# Altium schematic sheet MOTHER.SchDoc
size A4
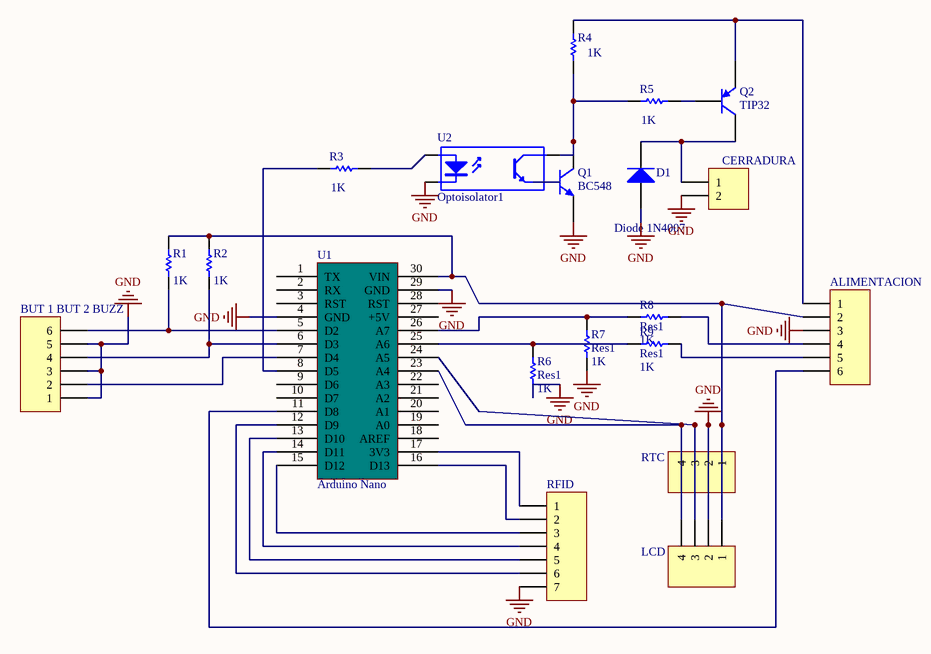
[diagram p0: MOTHER.SchDoc]

## Parts
ALIMENTACION  Header 6  [BORNERA 6 PIN]  (value not drawn)
BUT_1_BUT_2_BUZZ  Header 6  [BORNERA 6 PIN]  (value not drawn)
CERRADURA  Header 2  [Bornera 2 pin]  (value not drawn)
D1  Diode 1N4007  [DO-41]
LCD  Header 4  [BORNERA 4 PIN]  (value not drawn)
Q1  BC548  [TO-92A]
Q2  TIP32  [TO-220AB]
R1  value 1K  [AXIAL-0.3]  (hidden comment: Res1)
R2  value 1K  [AXIAL-0.3]  (hidden comment: Res1)
R3  value 1K  [AXIAL-0.3]  (hidden comment: Res1)
R4  value 1K  [AXIAL-0.3]  (hidden comment: Res1)
R5  value 1K  [AXIAL-0.3]  (hidden comment: Res1)
R6  Res1  value 1K  [AXIAL-0.3]
R7  Res1  value 1K  [AXIAL-0.3]
R8  Res1  value 1K  [AXIAL-0.3]
R9  Res1  value 1K  [AXIAL-0.3]
RFID  Header 7  [BORNERA 7 PIN]  (value not drawn)
RTC  Header 4  [BORNERA 4 PIN]  (value not drawn)
U1  Arduino Nano  [Arduino nano]
U2  Optoisolator1  [DIP-6]

## Nets
GND: ALIMENTACION.3 BUT_1_BUT_2_BUZZ.1 BUT_1_BUT_2_BUZZ.3 BUT_1_BUT_2_BUZZ.5 CERRADURA.2 D1.1(A) LCD.2 Q1.1(E) R6.1 R7.1 RFID.7 RTC.2 U1.4(GND) U1.29(GND) U2.2(K)
NetALIMENTACION_1: ALIMENTACION.1 Q2.1(E) R4.2
NetALIMENTACION_2: ALIMENTACION.2 LCD.1 R1.2 R2.2 RTC.1 U1.30(VIN)
NetALIMENTACION_4: ALIMENTACION.4 R8.2
NetALIMENTACION_5: ALIMENTACION.5 R9.2
NetALIMENTACION_6: ALIMENTACION.6 U1.11(D8)
NetBUT_1_BUT_2_BUZZ_2: BUT_1_BUT_2_BUZZ.2 U1.7(D4)
NetBUT_1_BUT_2_BUZZ_4: BUT_1_BUT_2_BUZZ.4 R2.1 U1.6(D3)
NetBUT_1_BUT_2_BUZZ_6: BUT_1_BUT_2_BUZZ.6 R1.1 U1.5(D2)
NetCERRADURA_1: CERRADURA.1 D1.2(K) Q2.3(C)
NetLCD_3: LCD.3 RTC.3 U1.24(A5)
NetLCD_4: LCD.4 RTC.4 U1.23(A4)
NetQ1_2: Q1.2(B) U2.3(E)
NetQ1_3: Q1.3(C) R4.1 R5.1 U2.4(C)
NetQ2_2: Q2.2(B) R5.2
NetR3_1: R3.1 U1.8(D5)
NetR3_2: R3.2 U2.1(A)
NetR6_2: R6.2 R9.1 U1.25(A6)
NetR7_2: R7.2 R8.1 U1.26(A7)
NetRFID_1: RFID.1 U1.17(3V3)
NetRFID_2: RFID.2 U1.16(D13)
NetRFID_3: RFID.3 U1.15(D12)
NetRFID_4: RFID.4 U1.14(D11)
NetRFID_5: RFID.5 U1.13(D10)
NetRFID_6: RFID.6 U1.12(D9)

Not connected (* = marked no-connect by the designer): U1 1(TX) 2(RX) 3(RST) 9(D6) 10(D7) 18(AREF) 19(A0) 20(A1) 21(A2) 22(A3) 27(+5V) 28(RST)

## Library data of the parts
ALIMENTACION = Header 6: Header, 6-Pin; pin to pad: 1>6 2>3 3>2 4>5 5>4 6>1; LatestRevisionDate: 17-Jul-2002; LatestRevisionNote: Re-released for DXP Platform.; Publisher: Altium Limited
BUT_1_BUT_2_BUZZ = Header 6: Header, 6-Pin; LatestRevisionDate: 17-Jul-2002; LatestRevisionNote: Re-released for DXP Platform.; Publisher: Altium Limited
CERRADURA = Header 2: Header, 2-Pin; pin to pad: 1>2 2>1; LatestRevisionDate: 17-Jul-2002; LatestRevisionNote: Re-released for DXP Platform.; Publisher: Altium Limited
D1 = Diode 1N4007: 1 Amp General Purpose Rectifier; Published: 8-Jun-2000; LatestRevisionDate: 17-Jul-2002; LatestRevisionNote: Re-released for DXP Platform.; DatasheetVersion: 1998; PackageVersion: Aug-1999; PackageReference: DO-41; Publisher: Altium Limited; PackageDescription: Diode, Axial; Body 5.2 x 2.7 mm (LxDia. max), Lead Dia. 0.86 mm (max); Code_JEDEC: DO-204-AL; ComponentLink1Description: Manufacturer Link; ComponentLink1URL: http://www.fairchildsemi.com/; ComponentLink2Description: Datasheet; ComponentLink2URL: http://www.fairchildsemi.com/ds/1N%2F1N4001.pdf
LCD = Header 4: Header, 4-Pin; pin to pad: 1>4 2>3 3>2 4>1; LatestRevisionDate: 17-Jul-2002; LatestRevisionNote: Re-released for DXP Platform.; Publisher: Altium Limited
Q1 = 2N3904: NPN General Purpose Amplifier; pin to pad: 1>3 3>1; Published: 8-Jun-2000; LatestRevisionDate: 15-Jan-2003; LatestRevisionNote: PCB Footprint 'BCY-W3/D4.7' replaced; DatasheetVersion: 1997; PackageVersion: Sep-1998; PackageReference: TO-92A; Publisher: Altium Limited; PackageDescription: TO, Flat Index; 3 In-Line, Axial Leads; Body Dia. 4.5mm; Leads 0.51 x 0.48 mm (max); ComponentLink1Description: Manufacturer Link; ComponentLink1URL: http://www.fairchildsemi.com/; ComponentLink2Description: Datasheet; ComponentLink2URL: http://www.fairchildsemi.com/ds/2N%2F2N3904.pdf
Q2 = 2N3906: PNP General Purpose Amplifier; pin to pad: 1>3 2>1 3>2; Published: 8-Jun-2000; LatestRevisionDate: 15-Jan-2003; LatestRevisionNote: PCB Footprint 'BCY-W3/D4.7' replaced; DatasheetVersion: 1997; PackageVersion: Sep-1998; PackageReference: TO-92A; Publisher: Altium Limited; PackageDescription: TO, Flat Index; 3 In-Line, Axial Leads; Body Dia. 4.5mm; Leads 0.51 x 0.48 mm (max); ComponentLink1Description: Manufacturer Link; ComponentLink1URL: http://www.fairchildsemi.com/; ComponentLink2Description: Datasheet; ComponentLink2URL: http://www.fairchildsemi.com/ds/2N%2F2N3906.pdf
R1-R9 = Res1: Resistor; Published: 8-Jun-2000; LatestRevisionDate: 17-Jul-2002; LatestRevisionNote: Re-released for DXP Platform.; PackageReference: AXIAL-0.3; Publisher: Altium Limited; PackageDescription: Axial Device, Thru-Hole; 2 Leads; 0.3 in Pin Spacing
RFID = Header 7: Header, 7-Pin; pin to pad: 1>2 2>1; LatestRevisionDate: 17-Jul-2002; LatestRevisionNote: Re-released for DXP Platform.; Publisher: Altium Limited
RTC = Header 4: Header, 4-Pin; LatestRevisionDate: 17-Jul-2002; LatestRevisionNote: Re-released for DXP Platform.; Publisher: Altium Limited
U1 = Component_1: pin to pad: 1>30 2>29 3>28 4>27 5>26 6>25 7>24 8>23 9>22 10>21 11>20 12>19 13>18 14>17 15>16 16>15 17>14 18>13 19>12 20>11 21>10 22>9 23>8 24>7 25>5 26>6 27>4 28>3 29>2 30>1
U2 = Optoisolator1: 4-Pin Phototransistor Optocoupler; pin to pad: 3>4 4>5; Published: 24-Mar-1999; LatestRevisionDate: 04-Mar-2005; LatestRevisionNote: Sch pins 3 & 4 Swapped.; DatasheetVersion: Nov-2003; PackageReference: DIP-4; Publisher: Altium Limited